# Altium schematic sheet REF_LCD.SchDoc
size A4; SheetNumber: 1; SheetTotal: 8
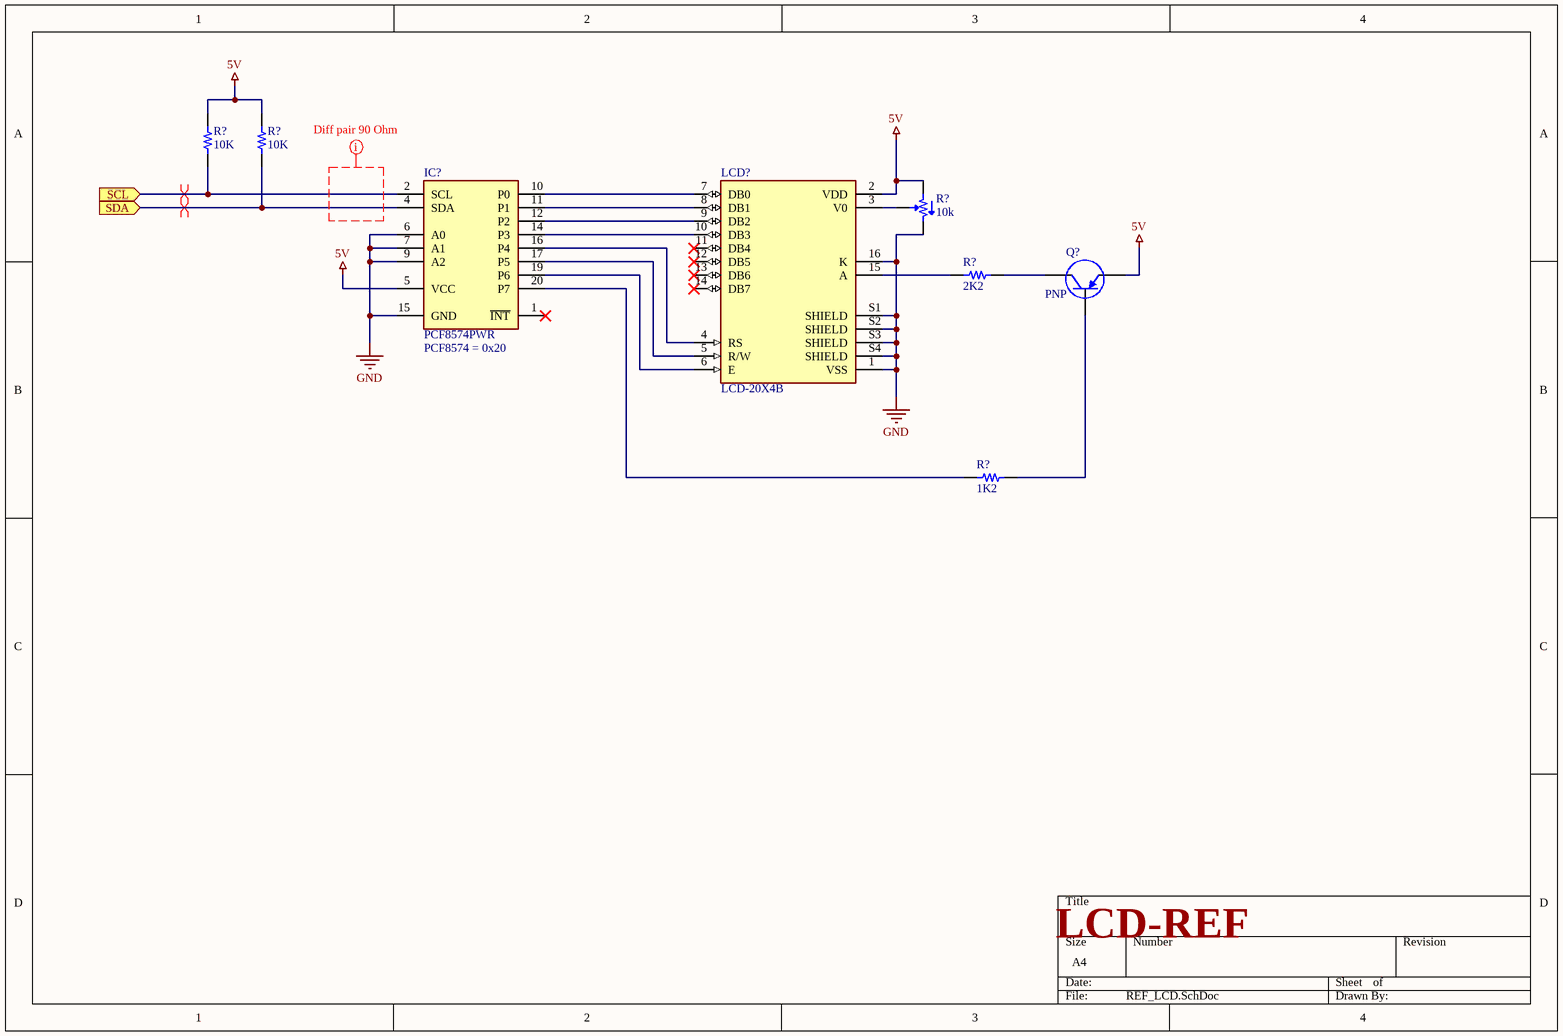
[diagram p0: REF_LCD.SchDoc]

## Parts
(Parts that share a designator on the sheet are numbered #1, #2 ... from top to bottom, then left to right.)
IC?  PCF8574PWR  [SOP65P640X120-20N]
LCD?  LCD-20X4B  [LCD_LCD-20X4B]
Q?  PNP  [SOT-23B_N]
R?#1  10K  [RES 0603/1608]
R?#2  10K  [RES 0603/1608]
R?#3  10k  [POT BOURNS TRIMPOT 3302]
R?#4  2K2  [RES 0603/1608]
R?#5  1K2  [RES 0603/1608]

## Ports
SCL (in), SDA (in)

## Nets
5V: IC?.5(VCC) LCD?.2(VDD) Q?.3(E) R?#1.2 R?#2.2 R?#3.1
GND: IC?.6(A0) IC?.7(A1) IC?.9(A2) IC?.15(GND) LCD?.1(VSS) LCD?.16(K) LCD?.S1(SHIELD) LCD?.S2(SHIELD) LCD?.S3(SHIELD) LCD?.S4(SHIELD) R?#3.3
SCL: IC?.2(SCL) R?#1.1 ; port SCL
SDA: IC?.4(SDA) R?#2.1 ; port SDA
NetIC?_10: IC?.10(P0) LCD?.7(DB0)
NetIC?_11: IC?.11(P1) LCD?.8(DB1)
NetIC?_12: IC?.12(P2) LCD?.9(DB2)
NetIC?_14: IC?.14(P3) LCD?.10(DB3)
NetIC?_16: IC?.16(P4) LCD?.4(RS)
NetIC?_17: IC?.17(P5) LCD?.5(R/W)
NetIC?_19: IC?.19(P6) LCD?.6(E)
NetIC?_20: IC?.20(P7) R?#5.1
NetLCD?_3: LCD?.3(V0) R?#3.2
NetLCD?_15: LCD?.15(A) R?#4.1
NetQ?_1: Q?.1(C) R?#4.2
NetQ?_2: Q?.2(B) R?#5.2

Not connected (* = marked no-connect by the designer): IC? 1(~{INT})*; LCD? 11(DB4)* 12(DB5)* 13(DB6)* 14(DB7)*

## Layout directives
differential pair: SCL, SDA
mark named Diff pair 90 Ohm: (no net found under the mark)

## Notes on the sheet
- (near IC?) PCF8574 = 0x20
- LCD-REF

## Library data of the parts
IC? = PCF8574PWR: IC Input/output (I/O) expander; Manufacturer_Name: Texas Instruments; Datasheet Link: http://www.ti.com/lit/ds/symlink/pcf8574.pdf; Height: 1.2mm; Manufacturer_Part_Number: PCF8574PWR; Mouser Part Number: 595-PCF8574PWR; Mouser Price/Stock: https://www.mouser.co.uk/ProductDetail/Texas-Instruments/PCF8574PWR?qs=X1HXWTtiZ0T3gnyuO%2Fq4CA%3D%3D; Arrow Part Number: PCF8574PWR; Arrow Price/Stock: https://www.arrow.com/en/products/pcf8574pwr/texas-instruments?region=nac
LCD? = LCD-20X4B: Display Development Tools 20X4 CHARACTER BLUE LCD W/BACKLIGHT; Value: *; Availability: Unavailable; Price: None; Package: None; MP: LCD-20X4B
Q? = BC327-25: PNP Bipolar Transistor; Published: 8-Jun-2000; LatestRevisionDate: 29-May-2009; LatestRevisionNote: IPC-7351 Footprint Added.; PackageVersion: Aug-1999; PackageReference: SOT-23B; Publisher: Altium Limited; PackageDescription: 3-Pin SOT-23 Package 0.95 mm Pitch, 2.4 mm Lead Span
R?#1 R?#2 = 0603S8J0103: RES SMD 10K OHM 5% 1/8W 0603; Manufacturer: Uniohm; TemperatureRange: -55C ~ 155C; TemperatureCoefficient: 100ppm/C; PowerRating: 0.125W, 1/8W; Value: 10K; Part Number: 0603S8J0103; Tolerance: 5%; Price: 0.0089; Device Package: 1608 (0603 Metric)
R?#3 = 3302W-3-103E: TRIMMER 10K OHM 0.15W SMD; Manufacturer: Bourns Inc.; TemperatureCoefficient: 250ppm/C; Tolerance: 25%; Number Of Turns: 1; Adjustment Type: Top Adjustment; Value: 10k; Part Number: 3302W-3-103E; PartId: 29445; Supplier 1: Digi-Key; Supplier Part Number 1: 3302W-103ECT-ND; ComponentLink1Description: Datasheet; ComponentLink1URL: http://www.bourns.com/docs/Product-Datasheets/3302.pdf; ComponentLink2Description: Digi-Key Listing; ComponentLink2URL: https://www.digikey.com/product-detail/en/bourns-inc/3302W-3-103E/3302W-103ECT-ND/612876; PowerRating: 0.15W; Price: 0.97
R?#4 = 0603S8J0222: RES SMD 2K2 OHM 5% 1/8W 0603; Manufacturer: Uniohm; TemperatureRange: -55C ~ 155C; TemperatureCoefficient: 100ppm/C; PowerRating: 0.125W, 1/8W; Value: 2K2; Part Number: 0603S8J0222; Tolerance: 5%; Price: 0.0089; Device Package: 1608 (0603 Metric)
R?#5 = 0603S8J0122: RES SMD 1K2 OHM 5% 1/8W 0603; Manufacturer: Uniohm; TemperatureRange: -55C ~ 155C; TemperatureCoefficient: 100ppm/C; PowerRating: 0.125W, 1/8W; Value: 1K2; Part Number: 0603S8J0122; Tolerance: 5%; Price: 0.0089; Device Package: 1608 (0603 Metric)